# Altium schematic sheet PWRBankCharger.SchDoc: PWRBankCharger
size Legal; DocumentNumber: 4; SheetNumber: 4; SheetTotal: 4; Conceptor: Philippe T. Simon B. Léonard G. Alexia B-L.; Version: Gamma 1.0
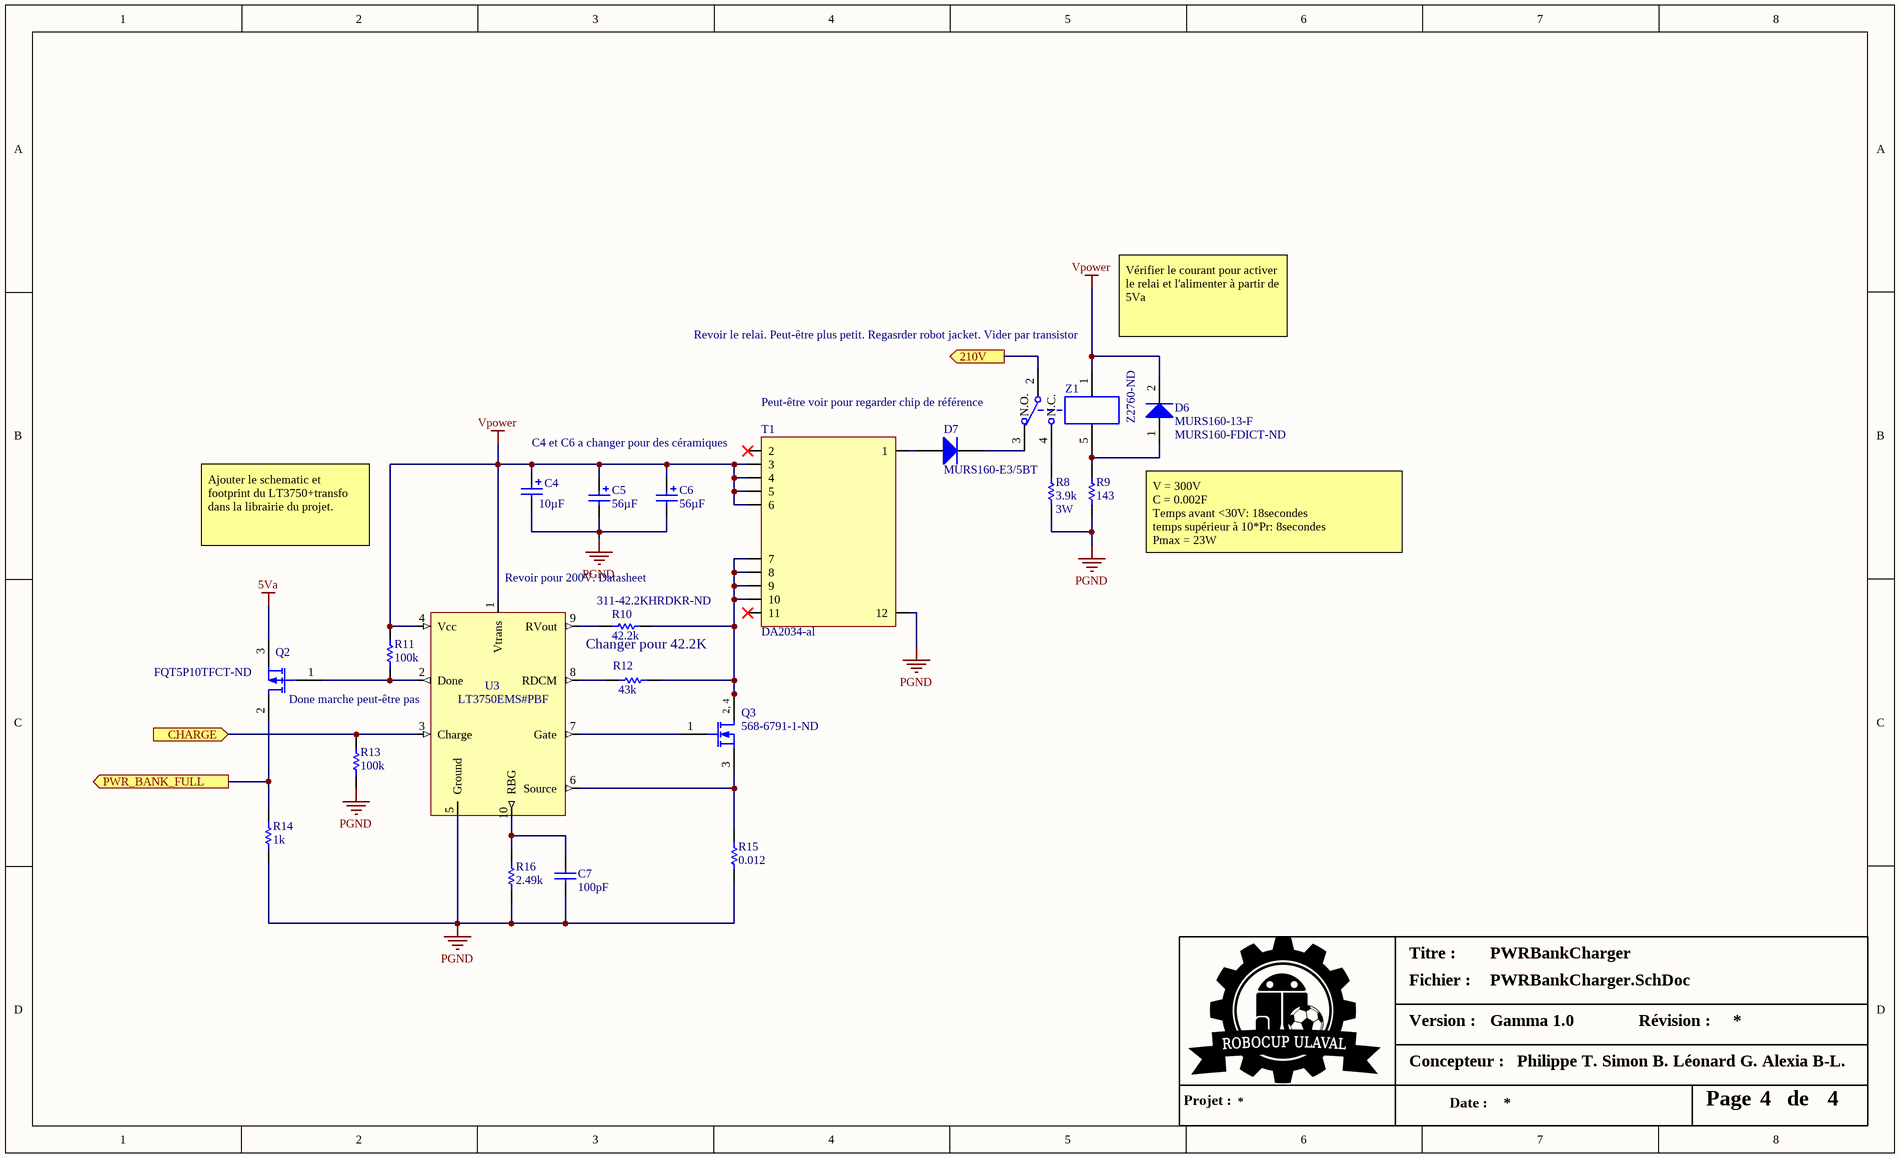
[diagram p0: PWRBankCharger.SchDoc]

## Parts
C4  Capacitance: 10µF  [0603]  (hidden comment: 865230340001)
C5  Capacitance: 56µF  [CAP 6.6x6.6mm]  (hidden comment: 865080545010)
C6  Capacitance: 56µF  [0603]  (hidden comment: 865080545010)
C7  Capacitance: 100pF  [0603]  (hidden comment: CL10B101KB8NNNC)
D6  MURS160-13-F  Supplier Part Number 1: MURS160-FDICT-ND  [SMB]
D7  MURS160-E3/5BT  [SMB]
Q2  Supplier Part Number 1: FQT5P10TFCT-ND  [SOT-223]  (hidden comment: FQT5P10TF)
Q3  Supplier Part Number 1: 568-6791-1-ND  [SOT-223]  (hidden comment: PHT6NQ10T,135)
R8  Resistance (Ohms): 3.9k  Power (Watts): 3W  [RWM4x10]  (hidden comment: RWM04103901JR15E1)
R9  Resistance (Ohms): 143  [1206]  (hidden comment: CRCW1206143RFKEA)
R10  Resistance (Ohms): 42.2k  Supplier Part Number 1: 311-42.2KHRDKR-ND  [0603]  (hidden comment: RC0603FR-0760K4L)
R11  Resistance (Ohms): 100k  [0603]  (hidden comment: RC0603JR-07100KL)
R12  Resistance (Ohms): 43k  [0603]  (hidden comment: RC0603JR-0743KL)
R13  Resistance (Ohms): 100k  [0603]  (hidden comment: RC0603JR-07100KL)
R14  Resistance (Ohms): 1k  [0603]  (hidden comment: RC0603JR-071KL)
R15  Resistance (Ohms): 0.012  [0805]  (hidden comment: RL1220T-R012-J)
R16  Resistance (Ohms): 2.49k  [0603]  (hidden comment: RC0603FR-072K49L)
T1  DA2034-al  [da2034]
U3  LT3750EMS#PBF  [MSOP-10]
Z1  Supplier Part Number 1: Z2760-ND  [G6RL]  (hidden comment: G6RL-1 DC12)

## Ports
210V (out), CHARGE (in), PWR_BANK_FULL (out)

## Nets
5Va: Q2.3(S)
PGND: C4.2 C5.2 C6.2 C7.2 R8.1 R9.2 R13.1 R14.1 R15.1 R16.1 T1.12 U3.5(Ground)
Vpower: C4.1 C5.1 C6.1 D6.2(K) R11.2 T1.3 T1.4 T1.5 T1.6 U3.1(Vtrans) U3.4(Vcc) Z1.1(Coil_Input_+)
210V: Z1.2(Signal_Input) ; port 210V
CHARGE: R13.2 U3.3(Charge) ; port CHARGE
PWR_BANK_FULL: Q2.2(D) R14.2 ; port PWR_BANK_FULL
NetC7_1: C7.1 R16.2 U3.10(RBG)
NetD6_1: D6.1(A) R9.1 Z1.5(Coil_Input_-)
NetD7_1: D7.1(A) T1.1
NetD7_2: D7.2(K) Z1.3(N.O.)
NetQ2_1: Q2.1(G) R11.1 U3.2(Done)
NetQ3_1: Q3.1(G) U3.7(Gate)
NetQ3_2: Q3.2(D) Q3.4(D) R10.2 R12.1 T1.7 T1.8 T1.9 T1.10
NetQ3_3: Q3.3(S) R15.2 U3.6(Source)
NetR8_2: R8.2 Z1.4(N.C.)
NetR10_1: R10.1 U3.9(RVout)
NetR12_2: R12.2 U3.8(RDCM)

Not connected (* = marked no-connect by the designer): T1 2* 11*

## Notes on the sheet
- Revoir le relai. Peut-être plus petit. Regasrder robot jacket. Vider par transistor
- Vérifier le courant pour activer le relai et l'alimenter à partir de 5Va
- (near Z1) Peut-être voir pour regarder chip de référence
- (near T1) C4 et C6 a changer pour des céramiques
- Ajouter le schematic et footprint du LT3750+transfo dans la librairie du projet.
- V = 300V
  C = 0.002F
  Temps avant <30V: 18secondes
  temps supérieur à 10*Pr: 8secondes
  Pmax = 23W
- Revoir pour 200V. Datasheet
- Done marche peut-être pas
- Changer pour 42.2K
- Titre :
- Version :
- Fichier :
- Révision :
- Projet :
- Concepteur :
- Date :
- Page
- de
- (in symbol PHT6NQ10T,135) 2, 4

## Library data of the parts
C4 = 865230340001: CAP 10 UF 20% 16 V; Manufacturer: Wurth Electronics Inc; Voltage Rating: 16V; Lifetime @ Temp.: 5000 Hrs @ 105°C; Polarization: Polar; Ripple Current: 17mA @ 100kHz; Surface Mount Land Size: 0.169" L x 0.169" W (4.30mm x 4.30mm); Supplier 1: Digi-Key; Supplier Part Number 1: 732-8250-1-ND; Manufacturer Part Number: 865230340001; RoHS: RoHS Compliant; Category: Capacitors; Stock 1: 1549; Pricing 1: 1=0.27, 50=0.2274, 100=0.1981, 250=0.17608, 500=0.15406, 1000=0.14673 (CAD); Packaging: Cut Tape (CT); Tolerance: ±20%; ESR (Equivalent Series Resistance): -; Operating Temperature: -40°C ~ 105°C; Applications: General Purpose; Impedance: -; Lead Spacing: -; Size / Dimension: 0.157" Dia (4.00mm); Height - Seated (Max): 0.217" (5.50mm); Mounting Type: Surface Mount; Package / Case: Radial, Can - SMD; ComponentLink1URL: http://katalog.we-online.de/pbs/datasheet/865230340001.pdf; ComponentLink1Description: http://katalog.we-online.de/pbs/datasheet/865230340001.pdf
C5 C6 = 865080545010: CAP 56 UF 20% 35 V; Manufacturer: Wurth Electronics Inc; Voltage Rating: 35V; Lifetime @ Temp.: 2000 Hrs @ 105°C; Polarization: Polar; Ripple Current: 250mA @ 100kHz; Impedance: 490 mOhm; Surface Mount Land Size: 0.260" L x 0.260" W (6.60mm x 6.60mm); Supplier 1: Digi-Key; Manufacturer Part Number: 865080545010; RoHS: RoHS Compliant; Category: Capacitors; Stock 1: 733; Pricing 1: 1=0.47, 50=0.3966, 100=0.3455, 250=0.30712 (CAD); Packaging: Cut Tape (CT); Tolerance: ±20%; ESR (Equivalent Series Resistance): -; Operating Temperature: -55°C ~ 105°C; Applications: General Purpose; Lead Spacing: -; Size / Dimension: 0.248" Dia (6.30mm); Height - Seated (Max): 0.303" (7.70mm); Mounting Type: Surface Mount; Package / Case: Radial, Can - SMD; ComponentLink1URL: http://katalog.we-online.de/pbs/datasheet/865080545010.pdf; ComponentLink1Description: http://katalog.we-online.de/pbs/datasheet/865080545010.pdf; Supplier Part Number 1: 732-8509-1-ND
C7 = CL10B101KB8NNNC: CAP CER 100PF 50V X7R 0603; Manufacturer: Samsung Electro-Mechanics America, Inc.; Tolerance: ±10%; Supplier 1: Digi-Key; Manufacturer Part Number: CL10B101KB8NNNC; RoHS: RoHS Compliant; Category: Capacitors; Stock 1: 68227; Pricing 1: 1=0.14, 10=0.017, 25=0.0124, 50=0.009, 100=0.0075, 250=0.00632, 500=0.00538, 1000=0.00422 (CAD); Packaging: Cut Tape (CT); Voltage - Rated: 50V; Temperature Coefficient: X7R; Mounting Type: Surface Mount, MLCC; Operating Temperature: -55°C ~ 125°C; Applications: General Purpose; Ratings: -; Package / Case: 0603 (1608 Metric); Size / Dimension: 0.063" L x 0.031" W (1.60mm x 0.80mm); Height - Seated (Max): -; Thickness (Max): 0.035" (0.90mm); Lead Spacing: -; Features: -; Lead Style: -; ComponentLink1URL: http://www.samsungsem.com/kr/support/product-search/mlcc/CL10B101KB8NNNC.jsp; ComponentLink1Description: http://www.samsungsem.com/kr/support/product-search/mlcc/CL10B101KB8NNNC.jsp; Supplier Part Number 1: 1276-1909-1-ND
D6 = MURS160-13-F: DIODE GEN PURP 600V 1A SMB; Manufacturer: Diodes Incorporated; Diode Type: Standard; Voltage - Forward (Vf) (Max) @ If: 1.25V @ 1A; Speed: Fast Recovery =< 500ns, > 200mA (Io); Reverse Recovery Time (trr): 50ns; Current - Reverse Leakage @ Vr: 5µA @ 600V; Capacitance @ Vr, F: 10pF @ 4V, 1MHz; Supplier 1: Digi-Key; Manufacturer Part Number: MURS160-13-F; RoHS: RoHS Compliant; Category: Discrete Semiconductor Products; Stock 1: 18621; Pricing 1: 1=0.55, 10=0.445, 100=0.303, 500=0.2268, 1000=0.16986 (CAD); Packaging: Cut Tape (CT); Part Status: Active; Voltage - DC Reverse (Vr) (Max): 600V; Current - Average Rectified (Io): 1A; Mounting Type: Surface Mount; Package / Case: DO-214AA, SMB; Supplier Device Package: SMB; Operating Temperature - Junction: -55°C ~ 175°C; ComponentLink1URL: http://www.diodes.com/_files/datasheets/ds30130.pdf; ComponentLink1Description: http://www.diodes.com/_files/datasheets/ds30130.pdf
D7 = MURS160-E3/5BT: DIODE GEN PURP 600V 2A DO214AA; Manufacturer: Vishay Semiconductor Diodes Division; Diode Type: Standard; Voltage - Forward (Vf) (Max) @ If: 1.25V @ 1A; Speed: Fast Recovery =< 500ns, > 200mA (Io); Reverse Recovery Time (trr): 75ns; Current - Reverse Leakage @ Vr: 5µA @ 600V; Supplier 1: Digi-Key; RoHS: RoHS Compliant; Category: Discrete Semiconductor Products; Stock 1: 4853; Pricing 1: 1=0.55, 10=0.442, 25=0.4044, 100=0.3011, 250=0.27296, 500=0.22592, 1000=0.16943 (CAD); Packaging: Cut Tape (CT); Part Status: Active; Voltage - DC Reverse (Vr) (Max): 600V; Current - Average Rectified (Io): 2A; Capacitance @ Vr, F: -; Mounting Type: Surface Mount; Package / Case: DO-214AA, SMB; Supplier Device Package: DO-214AA (SMB); Operating Temperature - Junction: -65°C ~ 175°C; ComponentLink1URL: http://www.vishay.com/docs/88688/murs140.pdf; ComponentLink1Description: http://www.vishay.com/docs/88688/murs140.pdf; Manufacturer Part Number: MURS160-E3/5BT
Q2 = FQT5P10TF: MOSFET P-CH 100V 1A SOT-223; Manufacturer: Fairchild Semiconductor; FET Type: MOSFET P-Channel, Metal Oxide; FET Feature: Standard; Current - Continuous Drain (Id) @ 25°C: 1A (Tc); Rds On (Max) @ Id, Vgs: 1.05 Ohm @ 500mA, 10V; Vgs(th) (Max) @ Id: 4V @ 250µA; Gate Charge (Qg) @ Vgs: 8.2nC @ 10V; Input Capacitance (Ciss) @ Vds: 250pF @ 25V; Power - Max: 2W; Supplier 1: Digi-Key; Manufacturer Part Number: FQT5P10TF; RoHS: RoHS Compliant; Category: Discrete Semiconductor Products; Stock 1: 526; Pricing 1: 1=0.86, 10=0.737, 100=0.5503, 500=0.43224, 1000=0.33321 (CAD); Packaging: Cut Tape (CT); Part Status: Active; Drain to Source Voltage (Vdss): 100V; Operating Temperature: -55°C ~ 150°C (TJ); Mounting Type: Surface Mount; Package / Case: TO-261-4, TO-261AA; Supplier Device Package: SOT-223-4; ComponentLink1URL: http://www.fairchildsemi.com/datasheets/FQ/FQT5P10.pdf; ComponentLink1Description: http://www.fairchildsemi.com/datasheets/FQ/FQT5P10.pdf
Q3 = PHT6NQ10T,135: MOSFET N-CH 100V 3A SOT223; Manufacturer: NXP Semiconductors; FET Type: MOSFET N-Channel, Metal Oxide; FET Feature: Standard; Current - Continuous Drain (Id) @ 25°C: 3A (Ta); Rds On (Max) @ Id, Vgs: 90 mOhm @ 3A, 10V; Vgs(th) (Max) @ Id: 4V @ 1mA; Gate Charge (Qg) @ Vgs: 21nC @ 10V; Input Capacitance (Ciss) @ Vds: 633pF @ 25V; Power - Max: 1.8W; Supplier 1: Digi-Key; Manufacturer Part Number: PHT6NQ10T,135; RoHS: RoHS Compliant; Category: Discrete Semiconductor Products; Stock 1: 9189; Pricing 1: 1=1.38, 10=1.242, 100=0.9684, 500=0.80092, 1000=0.6334 (CAD); Packaging: Cut Tape (CT); Part Status: Active; Drain to Source Voltage (Vdss): 100V; Operating Temperature: -65°C ~ 150°C (TJ); Mounting Type: Surface Mount; Package / Case: TO-261-4, TO-261AA; Supplier Device Package: SC-73; ComponentLink1URL: http://www.nxp.com/documents/data_sheet/PHT6NQ10T.pdf; ComponentLink1Description: http://www.nxp.com/documents/data_sheet/PHT6NQ10T.pdf
R8 = RWM04103901JR15E1: RES WIREWOUND 3.9K OHM 3W; Manufacturer: Vishay Sfernice; Tolerance: ±5%; Temperature Coefficient: ±75ppm/°C; Supplier 1: Digi-Key; Manufacturer Part Number: RWM04103901JR15E1; RoHS: RoHS Compliant; Category: Resistors; Stock 1: 947; Pricing 1: 1=1.64, 10=1.455, 25=1.3372, 50=1.2202, 100=1.0559, 250=0.8916, 500=0.75078 (CAD); Packaging: Cut Tape (CT); Part Status: Discontinued; Composition: Wirewound; Features: Flame Proof, Safety; Operating Temperature: -55°C ~ 350°C; Package / Case: Axial; Supplier Device Package: Axial; Size / Dimension: 0.217" Dia x 0.472" L (5.50mm x 12.00mm); Height: -; Number of Terminations: 2; Failure Rate: -; ComponentLink1URL: http://www.vishay.com/docs/50008/rwm.pdf; ComponentLink1Description: http://www.vishay.com/docs/50008/rwm.pdf; Supplier Part Number 1: RWMA-3.9KCT-ND
R9 = CRCW1206143RFKEA: RES SMD 143 OHM 1% 1/4W 1206; Manufacturer: Vishay Dale; Power (Watts): 0.25W, 1/4W; Temperature Coefficient: ±100ppm/°C; Supplier 1: Digi-Key; Manufacturer Part Number: CRCW1206143RFKEA; RoHS: RoHS Compliant; Category: Resistors; Stock 1: 11861; Pricing 1: 1=0.15, 10=0.081, 25=0.0588, 50=0.0452, 100=0.0332, 250=0.02532, 500=0.02024, 1000=0.01491, 2500=0.01294 (CAD); Packaging: Cut Tape (CT); Part Status: Active; Tolerance: ±1%; Composition: Thick Film; Features: Automotive AEC-Q200; Operating Temperature: -55°C ~ 155°C; Package / Case: 1206 (3216 Metric); Supplier Device Package: 1206; Size / Dimension: 0.126" L x 0.063" W (3.20mm x 1.60mm); Height: 0.024" (0.60mm); Number of Terminations: 2; Failure Rate: -; ComponentLink1URL: http://www.vishay.com/docs/20035/dcrcwe3.pdf; ComponentLink1Description: http://www.vishay.com/docs/20035/dcrcwe3.pdf; Supplier Part Number 1: 541-143FCT-ND
R10 = RC0603FR-0760K4L: RES SMD 42.2K OHM 1% 1/10W 0603; Manufacturer: Yageo; Power (Watts): 0.1W, 1/10W; Temperature Coefficient: ±100ppm/°C; Manufacturer Part Number: RC0603FR-0760K4L; RoHS: RoHS Compliant; Category: Resistors; Packaging: Cut Tape (CT); Tolerance: ±1%; Composition: Thick Film; Features: Moisture Resistant; Operating Temperature: -55°C ~ 155°C; Package / Case: 0603 (1608 Metric); Supplier Device Package: 0603; Size / Dimension: 0.063" L x 0.031" W (1.60mm x 0.80mm); Height: 0.022" (0.55mm); Number of Terminations: 2; Supplier 1: Digi-Key; ComponentLink1Description: https://www.digikey.ca/product-detail/en/yageo/RC0603FR-0742K2L/311-42.2KHRCT-ND/730176; ComponentLink1URL: https://www.digikey.ca/product-detail/en/yageo/RC0603FR-0742K2L/311-42.2KHRCT-ND/730176
R11 R13 = RC0603JR-07100KL: RES SMD 100K OHM 5% 1/10W 0603; Manufacturer: Yageo; Power (Watts): 0.1W, 1/10W; Temperature Coefficient: ±100ppm/°C; Supplier 1: Digi-Key; Manufacturer Part Number: RC0603JR-07100KL; RoHS: RoHS Compliant; Category: Resistors; Stock 1: 2803334; Pricing 1: 1=0.15, 10=0.017, 25=0.012, 100=0.0067, 250=0.00508, 500=0.00408, 1000=0.003, 2500=0.0026 (CAD); Packaging: Cut Tape (CT); Tolerance: ±5%; Composition: Thick Film; Features: Moisture Resistant; Operating Temperature: -55°C ~ 155°C; Package / Case: 0603 (1608 Metric); Supplier Device Package: 0603; Size / Dimension: 0.063" L x 0.031" W (1.60mm x 0.80mm); Height: 0.022" (0.55mm); Number of Terminations: 2; ComponentLink1URL: http://www.yageo.com/documents/recent/PYu-RC_Group_51_RoHS_L_04.pdf; ComponentLink1Description: http://www.yageo.com/documents/recent/PYu-RC_Group_51_RoHS_L_04.pdf; Supplier Part Number 1: 311-100KGRCT-ND
R12 = RC0603JR-0743KL: RES SMD 43K OHM 5% 1/10W 0603; Manufacturer: Yageo; Power (Watts): 0.1W, 1/10W; Temperature Coefficient: ±100ppm/°C; Supplier 1: Digi-Key; Manufacturer Part Number: RC0603JR-0743KL; RoHS: RoHS Compliant; Category: Resistors; Stock 1: 85147; Pricing 1: 1=0.15, 10=0.017, 25=0.012, 100=0.0067, 250=0.00508, 500=0.00408, 1000=0.003, 2500=0.0026 (CAD); Packaging: Cut Tape (CT); Tolerance: ±5%; Composition: Thick Film; Features: Moisture Resistant; Operating Temperature: -55°C ~ 155°C; Package / Case: 0603 (1608 Metric); Supplier Device Package: 0603; Size / Dimension: 0.063" L x 0.031" W (1.60mm x 0.80mm); Height: 0.022" (0.55mm); Number of Terminations: 2; ComponentLink1URL: http://www.yageo.com/documents/recent/PYu-RC_Group_51_RoHS_L_04.pdf; ComponentLink1Description: http://www.yageo.com/documents/recent/PYu-RC_Group_51_RoHS_L_04.pdf; Supplier Part Number 1: 311-43KGRCT-ND
R14 = RC0603JR-071KL: RES SMD 1K OHM 5% 1/10W 0603; Manufacturer: Yageo; Power (Watts): 0.1W, 1/10W; Temperature Coefficient: ±100ppm/°C; Supplier 1: Digi-Key; Manufacturer Part Number: RC0603JR-071KL; RoHS: RoHS Compliant; Category: Resistors; Stock 1: 1078221; Pricing 1: 1=0.15, 10=0.017, 25=0.012, 100=0.0067, 250=0.00508, 500=0.00408, 1000=0.003, 2500=0.0026 (CAD); Packaging: Cut Tape (CT); Tolerance: ±5%; Composition: Thick Film; Features: Moisture Resistant; Operating Temperature: -55°C ~ 155°C; Package / Case: 0603 (1608 Metric); Supplier Device Package: 0603; Size / Dimension: 0.063" L x 0.031" W (1.60mm x 0.80mm); Height: 0.022" (0.55mm); Number of Terminations: 2; ComponentLink1URL: http://www.yageo.com/documents/recent/PYu-RC_Group_51_RoHS_L_04.pdf; ComponentLink1Description: http://www.yageo.com/documents/recent/PYu-RC_Group_51_RoHS_L_04.pdf; Supplier Part Number 1: 311-1.0KGRCT-ND
R15 = RL1220T-R012-J: RES SMD 0.012 OHM 5% 1/4W 0805; Manufacturer: Susumu; Power (Watts): 0.25W, 1/4W; Temperature Coefficient: 0/ +350ppm/°C; Supplier 1: Digi-Key; Manufacturer Part Number: RL1220T-R012-J; RoHS: RoHS Compliant; Category: Resistors; Stock 1: 7258; Pricing 1: 1=0.54, 10=0.39, 25=0.288, 50=0.2124, 100=0.1558, 250=0.12876, 500=0.10616, 1000=0.07679 (CAD); Packaging: Cut Tape (CT); Part Status: Active; Tolerance: ±5%; Composition: Thin Film; Features: Current Sense; Operating Temperature: -55°C ~ 125°C; Package / Case: 0805 (2012 Metric); Supplier Device Package: 0805; Size / Dimension: 0.079" L x 0.049" W (2.00mm x 1.25mm); Height: 0.028" (0.70mm); Number of Terminations: 2; Failure Rate: -; ComponentLink1URL: http://www.susumu.co.jp/common/pdf/n_catalog_partition08_en.pdf; ComponentLink1Description: http://www.susumu.co.jp/common/pdf/n_catalog_partition08_en.pdf; Supplier Part Number 1: RL12T.012JCT-ND
R16 = RC0603FR-072K49L: RES SMD 2.49K OHM 1% 1/10W 0603; Manufacturer: Yageo; Power (Watts): 0.1W, 1/10W; Temperature Coefficient: ±100ppm/°C; Supplier 1: Digi-Key; Manufacturer Part Number: RC0603FR-072K49L; RoHS: RoHS Compliant; Category: Resistors; Stock 1: 319353; Pricing 1: 1=0.15, 10=0.021, 25=0.0152, 100=0.0086, 250=0.0066, 500=0.00526, 1000=0.00389, 2500=0.00337 (CAD); Packaging: Cut Tape (CT); Tolerance: ±1%; Composition: Thick Film; Features: Moisture Resistant; Operating Temperature: -55°C ~ 155°C; Package / Case: 0603 (1608 Metric); Supplier Device Package: 0603; Size / Dimension: 0.063" L x 0.031" W (1.60mm x 0.80mm); Height: 0.022" (0.55mm); Number of Terminations: 2; ComponentLink1URL: http://www.yageo.com/documents/recent/PYu-RC_Group_51_RoHS_L_04.pdf; ComponentLink1Description: http://www.yageo.com/documents/recent/PYu-RC_Group_51_RoHS_L_04.pdf; Supplier Part Number 1: 311-2.49KHRCT-ND
U3 = LT3750EMS#PBF: IC CONVERTER 10-MSOP; Manufacturer: Linear Technology; Supplier 1: Digi-Key; Manufacturer Part Number: LT3750EMS#PBF; RoHS: RoHS Compliant; Category: Integrated Circuits (ICs); Stock 1: 1621; Pricing 1: 1=9.94, 25=7.0624, 100=5.8196 (CAD); Packaging: Tube; Part Status: Active; Type: Flyback, Forward Converter; Applications: Power Supply Controller; Mounting Type: Surface Mount; Package / Case: 10-TFSOP, 10-MSOP (0.118", 3.00mm Width); Supplier Device Package: 10-MSOP; ComponentLink1URL: http://www.linear.com/docs/10239; ComponentLink1Description: http://www.linear.com/docs/10239
Z1 = G6RL-1 DC12: RELAY GEN PURPOSE SPDT 8A 12V; Manufacturer: Omron Electronics Inc-EMC Div; Relay Type: General Purpose; Coil Type: Non Latching; Coil Current: 18.3mA; Coil Voltage: 12VDC; Contact Form: SPDT (1 Form C); Switching Voltage: 400VAC, 300VDC - Max; Turn On Voltage (Max): 8.4 VDC; Turn Off Voltage (Min): 1.2 VDC; Operate Time: 10ms; Release Time: 5ms; Coil Power: 220 mW; Coil Resistance: 654 Ohms; Supplier 1: Digi-Key; Manufacturer Part Number: G6RL-1 DC12; RoHS: RoHS Compliant; Category: Relays; Stock 1: 680; Pricing 1: 1=4.79, 10=4.489, 25=3.99, 50=3.7906, 100=3.591, 250=3.19208, 500=2.99256, 1000=2.79306, 5000=2.69331 (CAD); Packaging: Bulk; Part Status: Active; Contact Rating (Current): 8A; Features: Sealed - Flux Protection; Mounting Type: Through Hole; Termination Style: PC Pin; Contact Material: Silver Nickel (AgNi); Operating Temperature: -40°C ~ 85°C; ComponentLink1URL: http://www.omron.com/ecb/products/pdf/en-g6rl.pdf; ComponentLink1Description: http://www.omron.com/ecb/products/pdf/en-g6rl.pdf
T1 = DA2034-al: Supplier 1: Coilcraft; Supplier Part Number 1: Da2034-al